# EAGLE design NixiTubeClock IN-4 (EAGLE 9.5.2)

## Sheet 1 of 3
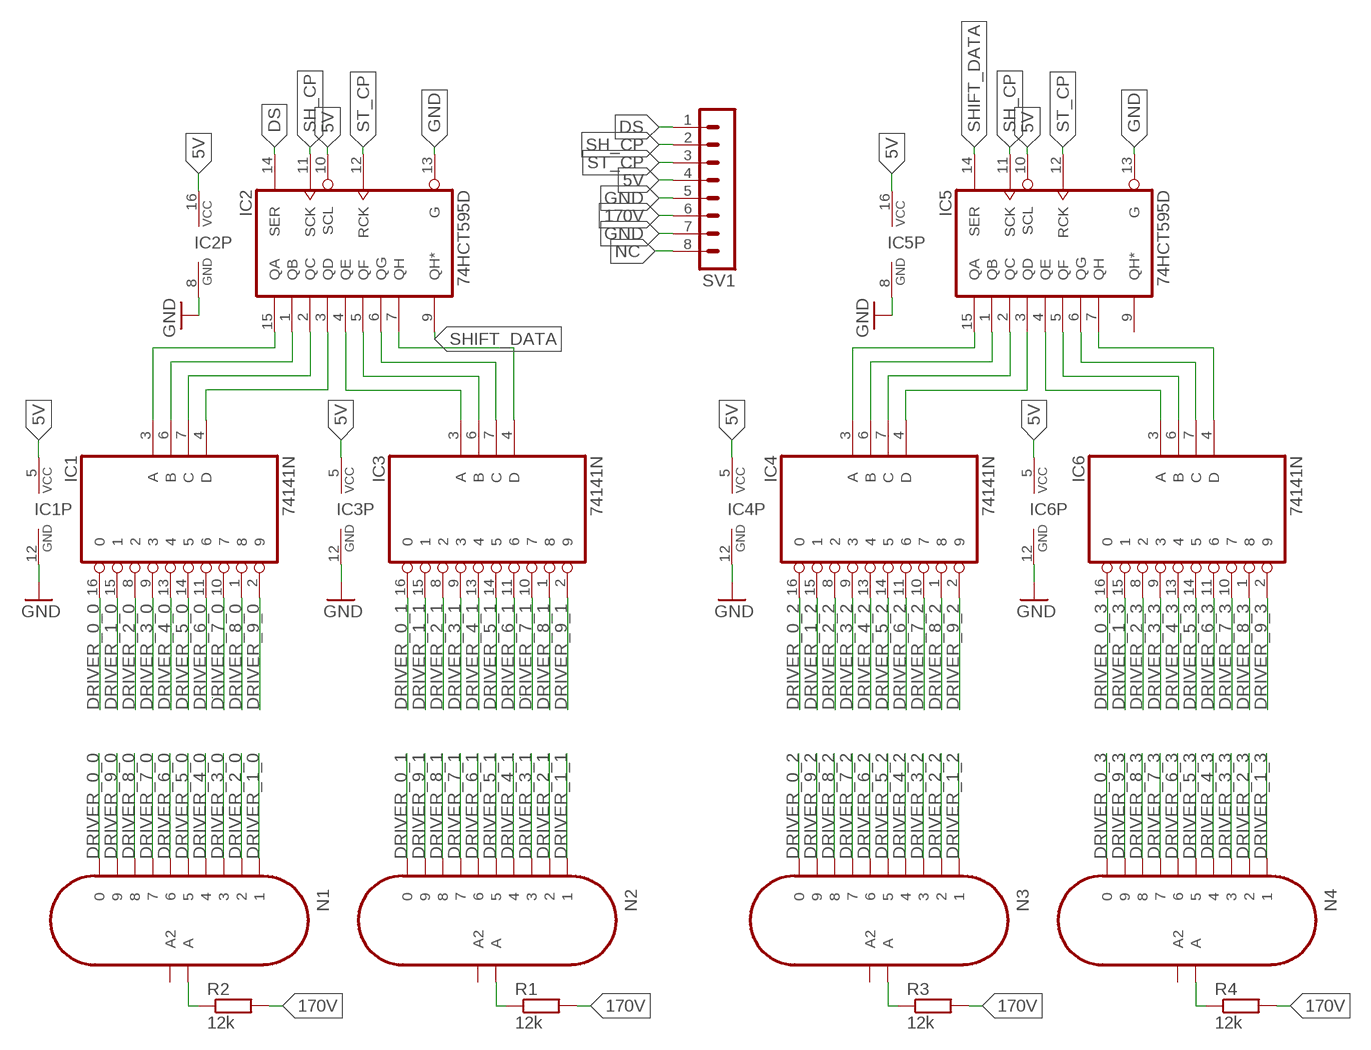
[diagram p0: schematic, sheet 1]

### Parts
IC1  74141N  [DIL16]
IC2  74HCT595D  [SO16]
IC3  74141N  [DIL16]
IC4  74141N  [DIL16]
IC5  74HCT595D  [SO16]
IC6  74141N  [DIL16]
N1  IN-4  [IN-18]
N2  IN-4  [IN-18]
N3  IN-4  [IN-18]
N4  IN-4  [IN-18]
R1  12k  R-EU_1206R1206  [R1206]
R2  12k  R-EU_1206R1206  [R1206]
R3  12k  R-EU_1206R1206  [R1206]
R4  12k  R-EU_1206R1206  [R1206]
SV1  MA08-1  [MA08-1]

### Nets
5V: IC1.5(VCC) IC2.10(SCL) IC2.16(VCC) IC3.5(VCC) IC4.5(VCC) IC5.10(SCL) IC5.16(VCC) IC6.5(VCC) SV1.4
170V: R1.2 R2.2 R3.2 R4.2 SV1.6
DRIVER_0_0: IC1.16 N1.N/C2
DRIVER_0_1: IC3.16 N2.N/C2
DRIVER_0_2: IC4.16 N3.N/C2
DRIVER_0_3: IC6.16 N4.N/C2
DRIVER_1_0: IC1.15 N1.9
DRIVER_1_1: IC3.15 N2.9
DRIVER_1_2: IC4.15 N3.9
DRIVER_1_3: IC6.15 N4.9
DRIVER_2_0: IC1.8 N1.8
DRIVER_2_1: IC3.8 N2.8
DRIVER_2_2: IC4.8 N3.8
DRIVER_2_3: IC6.8 N4.8
DRIVER_3_0: IC1.9 N1.1
DRIVER_3_1: IC3.9 N2.1
DRIVER_3_2: IC4.9 N3.1
DRIVER_3_3: IC6.9 N4.1
DRIVER_4_0: IC1.13 N1.N/C
DRIVER_4_1: IC3.13 N2.N/C
DRIVER_4_2: IC4.13 N3.N/C
DRIVER_4_3: IC6.13 N4.N/C
DRIVER_5_0: IC1.14 N1.A2
DRIVER_5_1: IC3.14 N2.A2
DRIVER_5_2: IC4.14 N3.A2
DRIVER_5_3: IC6.14 N4.A2
DRIVER_6_0: IC1.11 N1.4
DRIVER_6_1: IC3.11 N2.4
DRIVER_6_2: IC4.11 N3.4
DRIVER_6_3: IC6.11 N4.4
DRIVER_7_0: IC1.10 N1.7
DRIVER_7_1: IC3.10 N2.7
DRIVER_7_2: IC4.10 N3.7
DRIVER_7_3: IC6.10 N4.7
DRIVER_8_0: IC1.1 N1.5
DRIVER_8_1: IC3.1 N2.5
DRIVER_8_2: IC4.1 N3.5
DRIVER_8_3: IC6.1 N4.5
DRIVER_9_0: IC1.2 N1.6
DRIVER_9_1: IC3.2 N2.6
DRIVER_9_2: IC4.2 N3.6
DRIVER_9_3: IC6.2 N4.6
DS: IC2.14(SER) SV1.1
GND: IC1.12(GND) IC2.8(GND) IC2.13(G) IC3.12(GND) IC4.12(GND) IC5.8(GND) IC5.13(G) IC6.12(GND) SV1.5 SV1.7
N$1: IC4.4(D) IC5.3(QD)
N$4: N2.0(A) R1.1
N$5: N3.0(A) R3.1
N$7: N4.0(A) R4.1
N$12: N1.0(A) R2.1
N$101: IC1.3(A) IC2.15(QA)
N$102: IC1.6(B) IC2.1(QB)
N$103: IC1.7(C) IC2.2(QC)
N$104: IC1.4(D) IC2.3(QD)
N$105: IC2.4(QE) IC3.3(A)
N$106: IC2.5(QF) IC3.6(B)
N$107: IC2.6(QG) IC3.7(C)
N$108: IC2.7(QH) IC3.4(D)
N$109: IC4.3(A) IC5.15(QA)
N$110: IC4.6(B) IC5.1(QB)
N$111: IC4.7(C) IC5.2(QC)
N$113: IC5.4(QE) IC6.3(A)
N$114: IC5.5(QF) IC6.6(B)
N$115: IC5.6(QG) IC6.7(C)
N$116: IC5.7(QH) IC6.4(D)
NC: SV1.8
SH_CP: IC2.11(SCK) IC5.11(SCK) SV1.2
SHIFT_DATA: IC2.9(QH*) IC5.14(SER)
ST_CP: IC2.12(RCK) IC5.12(RCK) SV1.3
Unconnected: IC5.9(QH*) N1.2(A2) N2.2(A2) N3.2(A2) N4.2(A2)

## Sheet 2 of 3
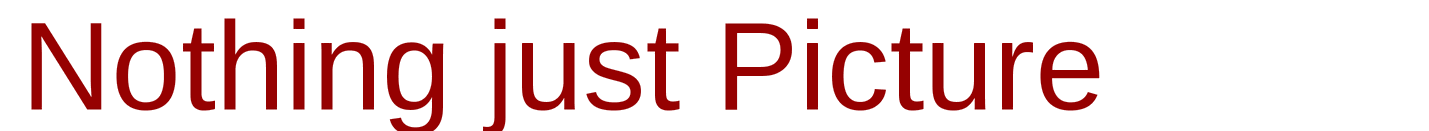
[diagram p1: schematic, sheet 2]

### Notes on the sheet
- Nothing just Picture

## Sheet 3 of 3

## Library data of the parts
IC1 IC3 IC4 IC6 = NixieTube:74*141: BCD to decimal DECODER/DRIVER
IC2 IC5 = NixieTube:74*595: 8-bit SHIFT REGISTER, output latch
N1-N4 = NixieTube:IN-4: IN-4: large numeric topview nixie tube
R1-R4 = CommonParts:R-EU_1206: RESISTOR, European symbol
SV1 = con-lstb:MA08-1: PIN HEADER; OC_FARNELL: unknown; OC_NEWARK: unknown

## Net classes
0 default: width 0.2 mm, drill 0.3 mm, clearance 0.1 mm
1 other: width 0.2 mm, drill 0.2 mm, clearance 0.1 mm

## Board
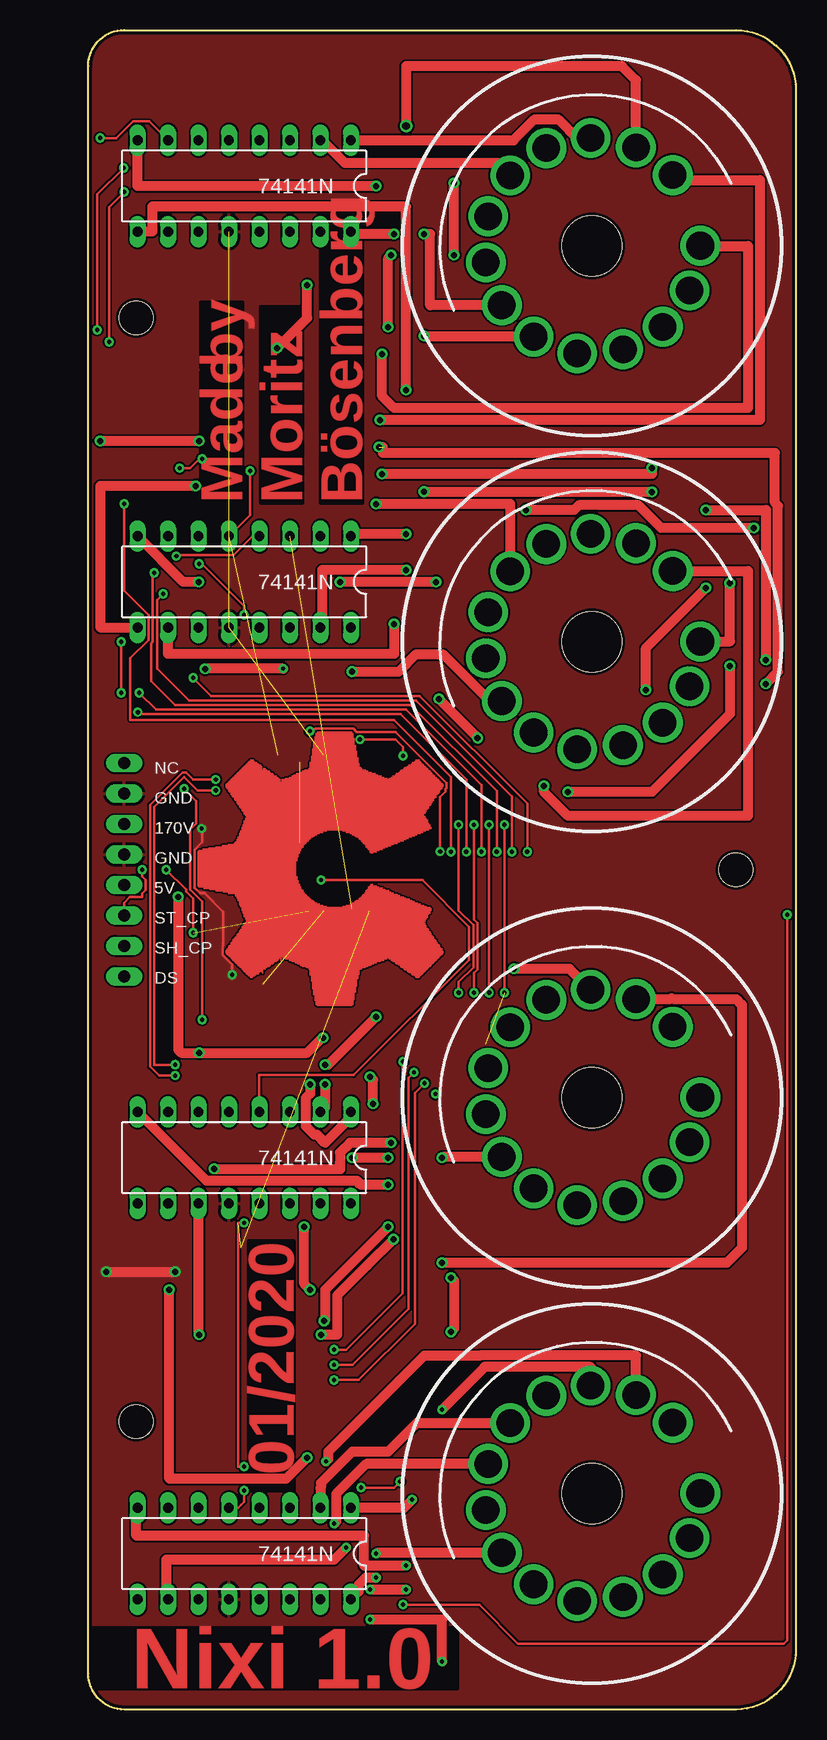
[diagram p2: board, top side]
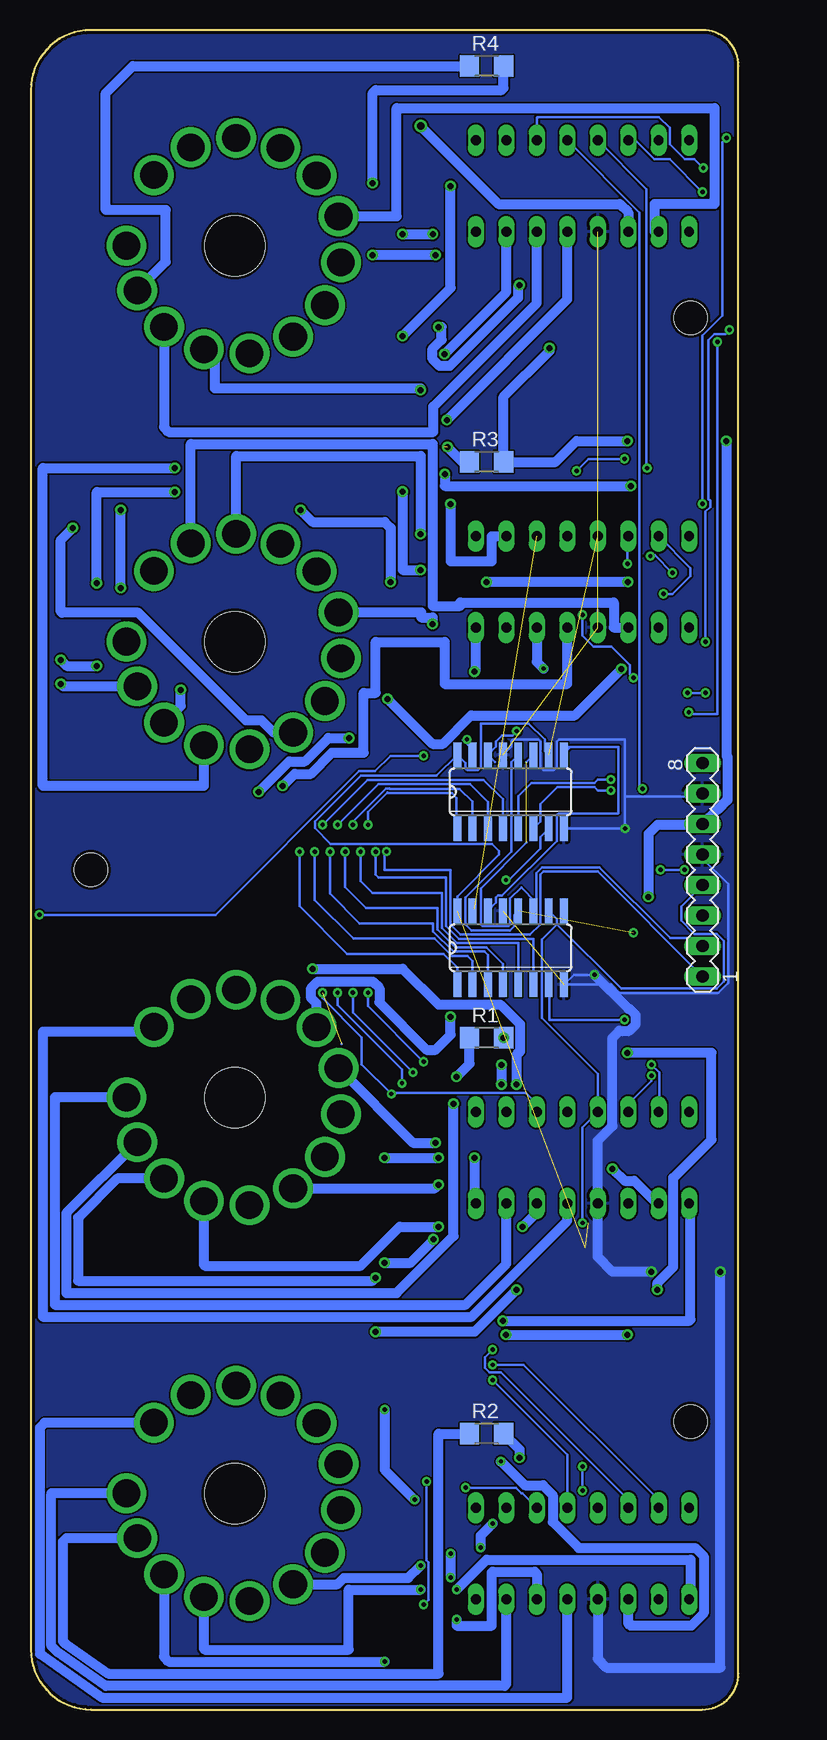
[diagram p3: board, bottom side, seen from below]

Size 59 x 140 mm. Coordinates in mm from the lower left corner, seen from the top.
Outline: 0,3 0,137 arc-90 3,140 54,140 arc-90 59,135 59,5 arc-90 54,0 3,0 arc-90 0,3
Copper layers (1*16): Top 0.035mm / dielectric 1.5mm / Bottom 0.035mm
Design rules "default *": minimum track width 6mil, minimum drill 0.35mm, track to track 6mil, track to pad 6mil, pad to pad 6mil, via to via 6mil, smd to smd 6mil, copper to edge 10mil, drill to drill 6mil, minimum pad ring 10mil, minimum via ring 8mil, stop-mask expansion 4mil, vias tented up to drill 0mil, thermal gap 10mil
Holes 2.8 mm at 4,116 54,70 4,24

### Footprints (pad centres in the part's own frame; a part is rotated, then mirrored left to right if it is on the bottom)
DIL16 = drill 0.813 long: 1 -8.89,-3.81; 2 -6.35,-3.81; 3 -3.81,-3.81; 4 -1.27,-3.81; 5 1.27,-3.81; 6 3.81,-3.81; 7 6.35,-3.81; 8 8.89,-3.81; 9 8.89,3.81; 10 6.35,3.81; 11 3.81,3.81; 12 1.27,3.81; 13 -1.27,3.81; 14 -3.81,3.81; 15 -6.35,3.81; 16 -8.89,3.81
SO16 = smd 0.66 x 2.032: 1 -4.445,-3.073; 2 -3.175,-3.073; 3 -1.905,-3.073; 4 -0.635,-3.073; 5 0.635,-3.073; 6 1.905,-3.073; 7 3.175,-3.073; 8 4.445,-3.073; 9 4.445,3.073; 10 3.175,3.073; 11 1.905,3.073; 12 0.635,3.073; 13 -0.635,3.073; 14 -1.905,3.073; 15 -3.175,3.073; 16 -4.445,3.073
IN-18 = drill 2.3 pad 3.2: 0 5.8,-6.8; 1 -1.3,-8.9; 2 -4.9,-7.6; 3 -8.6,2.5; 4 6.8,5.9; 5 3.7,8.2; 6 -3.7,8.2; 7 -6.8,5.9; 8 -7.6,-4.8; 9 8.2,-3.8; A 0,9; A2 2.5,-8.6; N/C 8.6,2.5; N/C2 -8.9,-1.3 | hole 5: 0,0
R1206 = smd 1.6 x 1.803: 1 -1.422,0; 2 1.422,0
MA08-1 = drill 1.016 long: 1 -8.89,0; 2 -6.35,0; 3 -3.81,0; 4 -1.27,0; 5 1.27,0; 6 3.81,0; 7 6.35,0; 8 8.89,0

### Placement (x,y rotation side)
IC1  13,13 180 top
IC2  19,76.5 0 bottom
IC3  13,46 180 top
IC4  13,94 180 top
IC5  19,63.5 0 bottom
IC6  13,127 180 top
N1  42,18 25 top
N2  42,51 25 top
N3  42,89 25 top
N4  42,122 25 top
R1  21,56 0 bottom
R2  21,23 0 bottom
R3  21,104 0 bottom
R4  21,137 0 bottom
SV1  3,70 90 bottom

### Tracks (layer width: path | path; a pad name or v marks a point on that pad's centre or on a via)
5V  (via drill 0.35)  (3 unrouted)
  Top 0.2: 12.73,17.06 13,17.33 v13,18.25 | v13,20.25 12.5,20.25 12.5,40.57
  Top 0.203: v7.62,103.48 8.48,103.48 9.25,104.25 v9.5,104.25 | v13.5,103.25 13.5,99.58 IC4.5 | 12.5,40.57 v13,40.57 | IC1.5 12.48,16.81 12.73,17.06
  Bottom 0.2: v13,18.25 v13,20.25
  Bottom 0.203: IC2.10 16.16,79.9 16.16,80.84 17.51,82.2 21.49,82.2 21.49,78.55 21.74,78.3 22.61,78.3 22.76,78.45 22.76,78.89 IC2.16 25.16,77.86 31.48,77.86 35.32,74.01 35.32,73.49 33.99,72.16 20.57,72.16 19.96,71.55 19.96,71.26 23.45,67.78 IC5.16 | SV1.4 4.78,66.95 4.78,65.77 3.67,64.67 1.82,64.67 1.22,64.07 1.22,60.69 1.82,60.09 9.78,60.09 15.14,65.45 | IC6.5 7.66,126.74 7.66,103.48 v7.62,103.48 | v9.5,104.25 12.5,104.25 v13.5,103.25 | v13,40.57 13,48.54 IC3.5 11.73,52.98 16.41,57.66 16.41,64.18 15.14,65.45 | 15.14,65.45 15.14,65.89 IC5.10
170V  (via drill 0.5)
  Top 0.813: v15.75,113.5 18.25,116 v18.25,118.75 | v25,115.25 25,121 v25.25,121.25 | v30.5,121.25 v30.5,127.25 | v9.25,105.75 v1,105.75 | v18.25,21 16.5,19.25 6.75,19.25 v6.75,35 | R1.2 19.5,56 18.25,54.75 v9.25,54.75 7.75,54.75 7.5,55 v7.5,67.75
  Bottom 0.813: v15.75,113.5 15.75,113.25 19.58,109.42 R3.2 15.25,104 13.5,105.75 v9.25,105.75 | v18.25,118.75 18.39,118.61 18.39,117.68 24.08,111.99 24.92,111.99 25.51,112.58 25.51,113.42 24.75,114.18 24.75,115.25 v25,115.25 | v30.5,127.25 30.5,134.75 30.25,135 19.75,135 19.58,135.17 R4.2 | v25.25,121.25 v30.5,121.25 | v1,105.75 1,79.52 0.92,79.44 0.92,75.8 1.69,75.03 1.78,75.03 SV1.6 3.06,73.75 6.75,73.75 7.5,73 v7.5,67.75 | R2.2 18.25,21.67 v18.25,21 | v6.75,35 6.75,35.57 5.43,36.89 5.43,44.32 2.25,47.5 2.25,54.75 v9.25,54.75
  other vias: 3,73.81 19.58,56
DRIVER_0_0  (via drill 0.35)
  Top 0.813: N1.N/C2 24.06,13.06 v24,13 | v24,11 23.96,10.96 23.1,10.96 22.54,10.4 22.54,9.84 IC1.16
  Bottom 0.813: v24,13 v24,11
DRIVER_0_1  (via drill 0.5)
  Top 0.813: N2.N/C2 29.56,46.06 v29.5,46 | v25,46 v22,46
  Bottom 0.813: v29.5,46 v25,46 | v22,46 22,42.3 IC3.16
DRIVER_0_2  (via drill 0.5)
  Top 0.813: N3.N/C2 33.49,84.06 29.63,87.93 27.29,87.93 25.86,86.5 v22,86.5 v22,86.51
  Bottom 0.813: v22,86.51 21.89,86.62 IC4.16
DRIVER_0_3  (via drill 0.5)
  Top 0.813: N4.N/C2 28.5,117.06 28.5,123 v28,123 | v25.49,123 21.89,123 IC6.16
  Bottom 0.813: v28,123 v25.49,123
DRIVER_1_0
  Bottom 0.813: N1.9 57.28,18.02 57.3,18 57.3,5.3 56.79,4.8 52.75,1.97 19.5,1.97 19.35,2.12 IC1.15
DRIVER_1_1
  Bottom 0.813: N2.9 56.98,51.02 57,51 57,33.75 22.75,33.75 19.35,37.15 IC3.15
DRIVER_1_2  (via drill 0.5)
  Top 0.813: N3.9 53.5,89.02 v53.5,93.89 53.5,93.94 | v47,101.5 v28,101.5 v28,101.51 | v26.51,95 19.5,95 19.5,90.19 IC4.15
  Bottom 0.813: v53.5,93.89 53.5,101.5 v47,101.5 | v28,101.51 28,95 v26.51,95
DRIVER_1_3  (via drill 0.5)
  Top 0.813: N4.9 51.06,122 55,122 55,108.5 25.5,108.5 24.5,109.5 v24.5,113
  Bottom 0.813: v24.5,113 19.35,118.15 IC6.15
DRIVER_2_0  (via drill 0.35)
  Top 0.813: v26.5,12 23,12 23,14.5 4,14.5 4,16.7 IC1.8
  Bottom 0.813: N1.8 33.43,10.44 32.9,10.96 27.54,10.96 v26.5,12
DRIVER_2_1  (via drill 0.5)
  Top 0.813: v25,43.75 22.71,43.75 22.39,44.07 9.85,44.07 IC3.8
  Bottom 0.813: N2.8 25.31,43.44 v25,43.75
DRIVER_2_2  (via drill 0.5)
  Top 0.813: v55.5,98.5 47.78,98.5 45.89,100.39 40.9,100.39 40.5,100 v36.5,100 | v29,94 26.94,94 26.93,93.99 26.09,93.99 26.08,94 v21,94 v21,93.99 | v9.21,94 7.92,94 IC4.8
  Bottom 0.813: N3.8 38.78,81.44 39.78,82.44 41.06,82.44 50.05,91.42 56.42,91.42 56.5,91.5 56.5,97.5 v55.5,98.5 | v36.5,100 35.5,99 29.5,99 29,98.5 v29,94 | v9.21,94 20.99,94 v21,93.99
DRIVER_2_3  (via drill 0.5)
  Top 0.813: N4.8 28,114.44 v28,114.5 | v24,127 4.11,127 IC6.8
  Bottom 0.813: v28,114.5 24,118.5 v24,127
DRIVER_3_0  (via drill 0.35)
  Top 0.813: v26.5,10 v23.5,10
  Bottom 0.813: N1.1 44.58,5.08 44.5,5 32.5,5 32.5,10 v26.5,10 | v23.5,10 21,12.5 4,12.5 4,9.3 IC1.9
DRIVER_3_1  (via drill 0.5)
  Top 0.813: v25,40.25 19.75,35 19.75,32.5 v19.66,32.41
  Bottom 0.813: N2.1 44.58,37.08 44.5,37 31.5,37 28.25,40.25 v25,40.25 | v19.66,32.41 4.09,32.41 4,32.5 4,42.08 IC3.9
DRIVER_3_2  (via drill 0.5)
  Top 0.813: v47,103.5 47,103 v24.49,103 | IC4.9 1,90.19 1,102 v8.96,102
  Bottom 0.813: N3.1 44.58,77 58,77 58,103.5 v47,103.5 | v24.49,103 24.49,102 v8.96,102 8.91,102
DRIVER_3_3  (via drill 0.5)
  Top 0.813: IC6.9 5.33,123.19 5.33,125.27 26.5,125.27 v26.5,110
  Bottom 0.813: N4.1 43.67,113.38 43.67,110.14 26.5,110.14 v26.5,110
DRIVER_4_0
  Bottom 0.813: N1.N/C 57.86,23.9 58.26,23.5 58.26,5 58.23,4.63 53.05,1 14.27,1 IC1.13
DRIVER_4_1
  Bottom 0.813: N2.N/C 49.14,56.5 58,56.5 58,32.75 22.25,32.75 14.27,40.73 IC3.13
DRIVER_4_2  (via drill 0.5)
  Top 0.813: N3.N/C 55,94.9 55,74.5 40,74.5 38,76.5 v38,77
  Bottom 0.813: v38,77 37,78 35.66,78 33.89,79.77 31.25,79.77 31.25,84.73 30.25,84.73 30.25,89 24.5,89 24.5,85.5 14.27,85.5 IC4.13
DRIVER_4_3  (via drill 0.5)
  Top 0.813: N4.N/C 49.14,127.5 56,127.5 56,107.5 v24.32,107.5
  Bottom 0.813: v24.32,107.5 14.27,117.56 IC6.13
DRIVER_5_0  (via drill 0.35)
  Top 0.813: v29.5,4 29.5,7.5 v23.5,7.5
  Bottom 0.813: N1.A2 47.9,4.4 47.5,4 v29.5,4 | v23.5,7.5 23.5,7 20.57,7 20.57,11.43 20.5,11.5 17,11.5 16.81,11.31 IC1.14
DRIVER_5_1  (via drill 0.5)
  Top 0.813: v18.5,34.99 18,35.49 v18,40.25 | v30.25,36 30.5,35.75 30.5,31.74 v30.25,31.49
  Bottom 0.813: N2.A2 51.79,44.26 55.07,40.98 55.07,35.75 30.5,35.75 v30.25,36 | v18.5,34.99 v18.5,35 22.01,31.49 v30.25,31.49 | v18,40.25 16.81,41.44 IC3.14
DRIVER_5_2  (via drill 0.35, 0.5)
  Top 0.813: v46.5,85 46.5,88.5 v51.5,93.5 | v51.5,100 56.5,100 56.5,98.93 56.51,98.92 56.51,98.08 56.5,98.07 v56.5,87.5 | v53.5,87 53.5,83 47,76.5 v40,76.5 | v32.47,80.97 32.47,81.03 v29.25,84.25 | v9.75,86.75 9.76,86.76 v16.25,86.76
  Bottom 0.813: N3.A2 46.5,83.66 v46.5,85 | v51.5,93.5 v51.5,100 | v56.5,87.5 56,87 v53.5,87 | v40,76.5 37.46,79.04 36.15,79.04 34.19,81 32.5,81 v32.47,80.97 | v29.25,84.25 25.5,80.5 24.66,80.5 22.3,82.86 13.64,82.86 v9.75,86.75 | IC4.14 16.81,87.32 v16.25,86.76
DRIVER_5_3
  Bottom 0.813: N4.A2 47.9,106.9 47.5,106.5 25.44,106.5 25.44,108.61 16.81,117.24 IC6.14
DRIVER_6_0  (via drill 0.35)
  Top 0.813: N1.4 45.67,29.52 32.65,29.52 32.63,29.5 28,29.5 20,21.5 20,20.86 v19.82,20.68
  Bottom 0.813: v19.82,20.68 17.82,18.69 16.3,18.69 15.49,17.87 15.49,15.64 13.31,13.46 3.6,13.46 2.89,12.76 2.89,8.03 3.92,7 9,7 9.19,7.19 IC1.11
DRIVER_6_1  (via drill 0.5)
  Top 0.813: N2.4 48.47,59.22 48.63,59.3 48.84,59.22 54.03,59.22 54.5,58.75 54.5,38.5 53.25,37.25 v29.5,37.25 | v25.45,39.2 23.25,37 | 23.25,37 | 23.25,37 20.75,34.5 20.75,31.25 v19.39,31.25 | v9.25,31.25 9.19,31.31 IC3.11
  Bottom 0.813: v29.5,37.25 27.33,37.25 25.41,39.16 25.41,39.17 v25.45,39.2 | v19.39,31.25 v9.25,31.25
DRIVER_6_2
  Bottom 0.813: N3.4 45.67,105.5 25.5,105.5 25.5,92 23.21,92 23.21,92.27 10.41,92.27 10.41,90.19 IC4.11
DRIVER_6_3  (via drill 0.65)
  Top 0.813: N4.4 45.67,135.83 44.5,137 26.5,137 v26.5,132
  Bottom 0.813: v26.5,132 20,125.5 9.89,125.5 9.19,124.8 IC6.11
DRIVER_7_0  (via drill 0.35)
  Top 0.813: N1.7 23.17,20.47 20.67,17.98 20.67,15.67 v20.5,15.5 | v21.5,13.5 20.5,12.5 6.5,12.5 6.5,9.34 IC1.10
  Bottom 0.813: v20.5,15.5 21.5,14.5 v21.5,13.5
DRIVER_7_1  (via drill 0.5)
  Top 0.813: v25.25,47.25 21.82,47.25 20.99,46.42 20.99,45.58 21,45.57 21,45.03 10.55,45.03 v10.5,45.08
  Bottom 0.813: N2.7 27.12,47.25 v25.25,47.25 | v10.5,45.08 9.49,44.07 8.69,44.07 6.8,42.19 IC3.10
DRIVER_7_2  (via drill 0.5)
  Top 0.813: v25.5,90.5 25.5,88 6.65,88 IC4.10
  Bottom 0.813: N3.7 26.46,91.47 26.46,91.03 25.5,91.03 v25.5,90.5
DRIVER_7_3
  Bottom 0.813: N4.7 28.5,124.47 28.5,133.5 2,133.5 2,125.5 7,125.5 7,123.19 IC6.10
DRIVER_8_0  (via drill 0.35)
  Top 0.813: N1.5 41.89,28.55 33,28.55 33,28.5 v29.5,25 | v27,17.5 26.31,16.81 IC1.1
  Bottom 0.813: v29.5,25 29.5,20 v27,17.5
DRIVER_8_1  (via drill 0.5)
  Top 0.813: N2.5 40.13,61.75 v35.5,61.75 | v18.5,52.09 18.5,51.34 18.13,50.98 18.13,48.65 18.84,47.93 19.07,47.93 19.75,47.25 21.89,49.39 IC3.1
  Bottom 0.813: v35.5,61.75 28,61.75 25.01,58.76 19.85,58.76 18.22,57.13 18.22,54.87 18.5,54.59 v18.5,52.09
DRIVER_8_2  (via drill 0.5)
  Top 0.813: v26.51,98 21.89,98 IC4.1
  Bottom 0.813: N3.5 41.89,104.5 26.5,104.5 v26.5,98 v26.51,98
DRIVER_8_3
  Top 0.813: IC6.1 23.75,130.81 25.5,130.81 35.46,130.81 36.33,131.68 37.2,132.55 39.19,132.55 40.75,131 N4.5
DRIVER_9_0
  Top 0.813: N1.6 27.37,23.87 25,21.5 22,21.5 19.39,18.89 19.39,18.52 19.35,18.48 IC1.2
DRIVER_9_1  (via drill 0.5)
  Top 0.813: v24,57.75 20,53.75 v19.75,53.75 | v19.75,52.09 19.75,50.21 IC3.2
  Bottom 0.813: N2.6 35.18,58.86 35.63,59.31 35.63,60.14 35.08,60.69 30.49,60.69 29.95,60.14 29.95,58.95 26,55 25.25,55 24,56.25 v24,57.75 | v19.75,53.75 v19.75,52.09
DRIVER_9_2  (via drill 0.5)
  Top 0.813: N3.6 35.18,100.5 v24,100.5
  Bottom 0.813: IC4.2 20.57,97.81 20.57,95.73 24,95.73 v24,100.5
DRIVER_9_3
  Top 0.813: IC6.2 19.5,130.81 21.39,128.93 34.12,128.93 N4.6
DS  (via drill 0.35)
  Top 0.203: v29.34,71.52 29.34,76.08 29.78,76.53 29.78,76.73 29.89,76.83 29.89,77.24 25.63,81.5 22.38,81.5 22.12,81.76 18.96,81.76 18.95,81.75 18.5,81.75 v18.5,81.57
  Bottom 0.203: 20.32,78.99 IC2.14 20.22,80.26 20.22,80.69 19.71,81.2 18.87,81.2 v18.5,81.57 | SV1.1 11.73,69.84 16.26,69.84 16.51,69.59 16.51,65.45 17.37,64.59 23.17,64.59 24.03,65.45 24.03,69.97 | 24,70 24.03,69.97 | 24.03,69.97 29.47,69.97 29.5,70 29.5,71.25 29.25,71.5 29.27,71.52 v29.34,71.52
GND  (via drill 0.35, 0.5)  (3 unrouted)
  Top 0.203: v12,61.25 12,62.1 11.19,62.91 11.19,63.63 11.25,63.69 11.25,66.5 9.71,68.05 9.31,68.05 8.85,68.5 8.85,71.66 9.5,72.3 9.5,73.5 9.45,73.45 v9.45,73.43
  Top 0.813: v1.5,36.5 v7.25,36.5
  Bottom 0.203: IC2.13 18.95,80.26 18.95,80.69 18.8,80.84 16.66,80.84 16.51,80.69 16.51,78.55 16.26,78.3 15.39,78.3 15.14,78.55 15.14,80.69 14.99,80.84 9.48,80.84 9.48,76.1 | 9.48,76.1 3.25,76.1 SV1.7 | IC2.8 v9.45,73.43 9.48,73.45 9.48,76.1 | SV1.5 3,70.93 0.87,68.8 0.87,60.54 1.67,59.74 9.93,59.74 10.62,60.43 IC5.8 13.73,61.25 v12,61.25
  Bottom 0.813: IC1.12 11.73,4.23 11,3.5 1.5,3.5 v1.5,36.5 | v7.25,36.5 10.5,36.5 11.73,37.73 IC3.12 11.73,47.42 10.51,48.65 10.51,55.99 9.94,56.56 9.11,56.56 8.56,57.11 8.56,57.89 9.11,58.44 9.19,58.44 v12,61.25
  pour Top: 0,0 59,0 59,140 0,140
  pour Bottom: 0,0 59,0 59,140 0,140
N$1  (via drill 0.35)
  Top 0.203: v34.06,71.5 34.06,76.58 26.89,83.75 7.25,83.75 5.25,85.75 5.25,88.87 5.38,89 5.38,94.63 v5.5,94.75 | v7.34,96.16 7.42,96.23 12.11,96.23 13.68,97.81 IC4.4
  Bottom 0.203: IC5.3 20.91,62.9 21.17,63.17 23.76,63.17 25.45,64.86 25.45,65.54 31.58,65.54 34.06,68.02 v34.06,71.5 | v5.5,94.75 6.99,96.23 7.03,96.23 7.04,96.25 7.25,96.25 v7.34,96.16
N$4  (via drill 0.5)
  Top 0.813: v23.75,50.5 23.75,52.5 v23.5,52.75
  Bottom 0.813: N2.0 56.03,41.38 56.03,34.72 28.5,34.72 23.75,39.47 v23.75,50.5 | v23.5,52.75 22.42,53.83 R1.1
N$5  (via drill 0.5)  (1 unrouted)
  Top 0.813: v56.5,85.5 57.51,86.51 57.51,100.35 57.25,100.61 57.25,104.75 24.57,104.75 24.57,105.25
  Bottom 0.813: N3.0 56.29,85.29 v56.5,85.5 | v24.25,105.25 23,104 R3.1
N$7
  Bottom 0.813: N4.0 47.75,120.67 47.75,125 52.75,125 52.75,134.75 50.5,137 R4.1
N$12
  Bottom 0.813: N1.0 56.05,14.29 56.33,14 56.33,5.71 56.17,5.54 52.54,3 25,3 25,23 R2.1
N$101  (via drill 0.35)
  Top 0.203: v22.64,80.87 25.63,80.87 26.25,80.25 v26.25,79.5 | v58.29,66.25 58.29,21.04 | 58.29,21.04 58.25,21 | 58.29,21.04 58.29,5.79 58,5.5 35.85,5.5 32.6,8.75 v26.25,8.75 | v26,19 25.5,18.5 v22.75,18.5
  Bottom 0.203: IC2.15 22.18,80.01 22.96,80.79 22.88,80.87 v22.64,80.87 | v26.25,79.5 29,79.5 30.29,78.21 31.63,78.21 43.59,66.25 v58.29,66.25 58.5,66.25 | v26.25,8.75 25.84,9.16 25.84,12.27 26,12.43 v26,19 | v22.75,18.5 18.57,18.5 18.1,18.03 18.03,18.03 IC1.3
N$102  (via drill 0.35)
  Top 0.203: v30.88,73.75 30.88,66.62 32.11,65.4 32.11,61.85 30.88,60.63 v30.88,59.75 | v26.25,54 26.19,53.94 26.19,34.69 21.5,30 v20.5,30
  Bottom 0.203: IC2.1 23.45,73.29 23.5,73.23 23.5,76 23.89,76.39 29.21,76.39 29.25,76.43 30.88,74.8 v30.88,73.75 | v30.88,59.75 30.88,58.63 v26.25,54 | IC1.6 9.19,17.47 19.81,28.09 20.76,28.09 21.13,28.47 21.13,29.37 v20.5,30
N$103  (via drill 0.35)
  Top 0.203: v32.15,73.75 32.15,65.85 32.46,65.55 32.46,61.7 32.15,61.4 v32.15,59.75 | v27.15,53.1 26.71,52.66 26.71,33.41 22.03,28.73 v20.5,28.73
  Bottom 0.203: IC2.2 22.18,75.67 23.25,76.75 29.06,76.75 29.1,76.79 29.4,76.79 32.15,74.03 v32.15,73.75 | v32.15,59.75 32.15,58.11 v27.15,53.1 | IC1.7 6.65,17.47 17.91,28.73 v20.5,28.73
N$104  (via drill 0.35)
  Top 0.203: v28.05,52.2 27.23,51.39 27.23,32.14 22.55,27.46 v20.5,27.46 | v33.42,73.75 v33.42,59.75
  Bottom 0.203: IC2.3 20.91,75.66 22.39,77.14 30.03,77.14 v33.42,73.75 | v20.5,27.46 14.27,21.23 IC1.4 | v33.42,59.75 33.42,58.75 28.05,53.37 v28.05,52.2
N$105  (via drill 0.35)  (1 unrouted)
  Top 0.203: v34.69,73.75 v34.69,59.75
  Bottom 0.203: IC2.4 19.64,75.89 21.25,77.5 30.94,77.5 v34.69,73.75 | IC3.3 16.81,50.47 17.72,51.38 28.86,51.38 v28.94,51.31 31.42,53.78 31.42,56.03 34.69,59.3 v34.69,59.75 | 33.12,55.48 33.11,55.48
N$106  (via drill 0.35)
  Top 0.203: v10.63,77.53 8.72,77.53 8.15,78.1 7.85,78.1 5.14,75.4 5.14,53.6 5.91,52.84 v7.25,52.84
  Bottom 0.203: IC2.5 18.36,76.14 17.25,77.25 12,77.25 11.72,77.53 v10.63,77.53 | IC3.6 9.19,50.47 7.25,52.41 v7.25,52.84
N$107  (via drill 0.35)
  Top 0.203: v10.63,76.62 9.13,76.62 8,77.75 5.5,75.25 5.5,53.75 v7.25,53.75
  Bottom 0.203: IC2.6 16.5,74.02 16.5,75.5 15.11,76.89 12,76.89 11.72,76.62 v10.63,76.62 | IC3.7 6.65,50.47 6.62,50.5 6.62,53.12 v7.25,53.75
N$108  (via drill 0.35)
  Top 0.203: v19.4,69.15 27.85,69.15 31.75,65.25 31.75,62.5 22.14,52.88 14.22,52.88 14.22,49.86 IC3.4
  Bottom 0.203: IC2.7 16.51,72.74 16.51,71.79 19.15,69.15 v19.4,69.15
N$109  (1 unrouted)
  Bottom 0.203: IC5.15 22,66.75
N$110  (via drill 0.35)
  Top 0.203: v36.6,71.5 36.6,75.52 27.62,84.5 10.25,84.5 v8.75,86 | v13,91.25 13,92 9.5,95.5 v9.25,95.5
  Bottom 0.203: IC5.1 23.45,61.85 24.6,63 32.63,63 36.6,66.97 v36.6,71.5 | v8.75,86 9.04,86.29 9.04,87.04 10.62,88.61 12.11,88.61 13,89.51 v13,91.25 | v9.25,95.5 9.25,97.75 IC4.6
N$111  (via drill 0.35)
  Top 0.203: v35.33,71.5 35.33,76.1 27.33,84.11 8.39,84.11 5.74,86.76 5.74,92.49 v6.25,93
  Bottom 0.203: IC5.2 22.18,62.38 22.61,62.81 23.91,62.81 25.36,64.27 32.1,64.27 35.33,67.5 v35.33,71.5 | v6.25,93 5.5,93 4,94.5 4,95.16 IC4.7
N$113  (via drill 0.35)
  Top 0.203: v32.79,71.5 32.79,77.05 26.49,83.36 5.64,83.36 v4.25,84.75 | v2.75,84.75 v2.75,89 | v0.75,115 0.75,126.31 v2.94,128.5
  Bottom 0.203: v32.79,71.5 32.79,68.55 31.05,66.81 25.1,66.81 25.1,65.01 23.61,63.52 21.03,63.52 19.64,62.13 IC5.4 | v4.25,84.75 v2.75,84.75 | v2.75,89 2.75,99.86 2.37,100.24 2.37,100.76 2.5,100.89 2.5,114.14 2.01,114.63 1.12,114.63 v0.75,115 | v2.94,128.5 3.67,129.24 4.49,129.24 5.74,130.48 5.74,131.85 6.64,132.75 16.75,132.75 16.81,132.69 IC6.3
N$114  (via drill 0.35)
  Top 0.203: v31.52,71.5 31.52,77.53 26.05,83 4,83 v4.13,83.13 | v1.75,114 1.75,125.25 v3,126.5
  Bottom 0.203: IC5.5 18.36,63.88 23.46,63.88 24.74,65.16 24.74,68.08 30.53,68.08 31.52,69.07 v31.52,71.5 | v4.13,83.13 4,83 1.75,83 v1.75,114 | v3,126.5 5.74,129.24 7.03,129.24 8.6,130.81 IC6.6
N$115  (via drill 0.35)
  Top 0.203: v30.25,71.5 30.25,77.75 25.5,82.5 3.5,82.5 3.5,87.63 5.02,89.15 5.02,91.23 3,93.25 v3,100.5 | v1,131 2.35,131 3.73,132.38 5.08,132.38 IC6.7
  Bottom 0.203: v30.25,71.5 30.25,69.6 30,69.35 24.39,69.35 24.39,65.31 23.32,64.24 17.09,64.24 IC5.6 | v3,100.5 3,114.52 1.34,116.18 1.34,130.66 v1,131
N$116  (via drill 0.35)
  Top 0.203: v9.5,57.5 9.5,67.35 8.5,68.35 8.5,73.37 9,73.87 9,75.75 v8,76.75
  Bottom 0.203: IC5.7 15.75,60.35 15.75,57.5 v9.5,57.5 | v8,76.75 8.25,77 8.25,124.79 IC6.4
SH_CP  (1 unrouted)
  Bottom 0.203: IC2.11 17.68,78.99 | IC5.11 17.09,67.16 16.92,67.33 | 16.92,67.33 18.11,68.53 19.05,67.59 19.05,65.45 19.2,65.3 21.34,65.3 21.49,65.45 21.49,68.44 17.68,72.25 | SV1.2 3.66,64.31 5.7,64.31 11.59,70.2 16.41,70.2 16.87,69.74 16.87,67.38 16.92,67.33
SHIFT_DATA
  Bottom 0.203: IC5.14 20.22,67.26 20.22,67.69 20.07,67.84 19.7,67.84 15.14,72.41 15.14,74.55 14.99,74.7 10.05,74.7 10,74.75 10,80.25 14,80.25 | 14,80.25 14.5,80.25 | 14,80.25 14.55,79.69 IC2.9
ST_CP  (via drill 0.35)  (1 unrouted)
  Top 0.203: SV1.3 3,67.25 3.46,67.71 4.18,67.71 4.22,67.75 4.5,67.75 4.5,68.03 4.78,68.31 4.78,69.15 4.5,69.43 v4.5,70 | v6.5,70 8.14,68.36 8.14,68.2 8.75,67.6 v8.75,64.75
  Bottom 0.203: IC2.12 18.95,78.99 18.95,71.5 22.76,67.69 22.76,65.45 22.25,64.95 19.05,64.95 18.7,65.31 18.7,66.24 IC5.12 | v4.5,70 v6.5,70
(copper drawn outside any net)
  shapes: Top area x369

### Text on the board
Top: by | Made | Moritz | Bösenberg | 01/2020 | Nixi 1.0
tNames: NC | GND | 170V | GND | 5V | ST_CP | SH_CP | DS
tStop: by | Made | Moritz | Bösenberg | 01/2020 | Nixi 1.0
tKeepout: Nixi 1.0